# Altium schematic sheet ISO.SchDoc
size A4
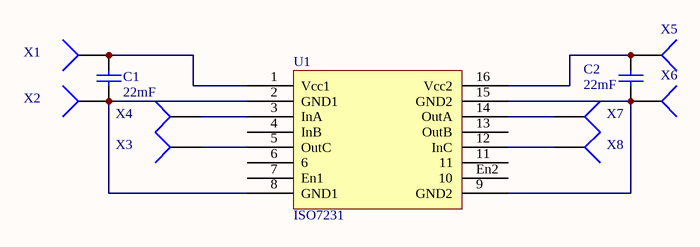
[diagram p0: ISO.SchDoc]

## Parts
C1  22mF  [C3216-1206]
C2  22mF  [C3216-1206]
U1  ISO7231  [SO-G16/D10.4]
X1  (no value)  [PIN1]
X2  (no value)  [PIN1]
X3  (no value)  [PIN1]
X4  (no value)  [PIN1]
X5  (no value)  [PIN1]
X6  (no value)  [PIN1]
X7  (no value)  [PIN1]
X8  (no value)  [PIN1]

## Nets
NetC1_1: C1.1 U1.2(GND1) U1.8(GND1) X2.1
NetC1_2: C1.2 U1.1(Vcc1) X1.1
NetC2_1: C2.1 U1.9(GND2) U1.15(GND2) X6.1
NetC2_2: C2.2 U1.16(Vcc2) X5.1
NetU1_3: U1.3(InA) X4.1
NetU1_5: U1.5(OutC) X3.1
NetU1_12: U1.12(InC) X8.1
NetU1_14: U1.14(OutA) X7.1

Not connected (* = marked no-connect by the designer): U1 4(InB) 6 7(En1) 11 13(OutB) En2(10)

## Library data of the parts
C1 C2 = Cap Semi: Capacitor (Semiconductor SIM Model); Manufacturer: Generic Components; Class I: Passive; Value: 1,0; Published: 8-Jun-2000; Revision: July-2002: Re-released for DXP Platform.; Publisher: Altium Limited; Class II: Capacitor
X1-X8 = Socket: Manufacturer: Generic Components; Class I: Connector; Revision: July-2002: Re-released for DXP Platform.; Publisher: Altium Limited